# EasyEDA Pro project 单向户外电源_明月班.epro, schematic Schematic2

## Sheets
1 P1: Board Name: 逆变V2.0; Create Date: 2025-09-20; Page Name: P1; Project Name: 单向户外电源; Schematic Name: Schematic2; Update Date: 2025-11-14; Company: 嘉立创EDA; Page Size: A4; Version: V1.0
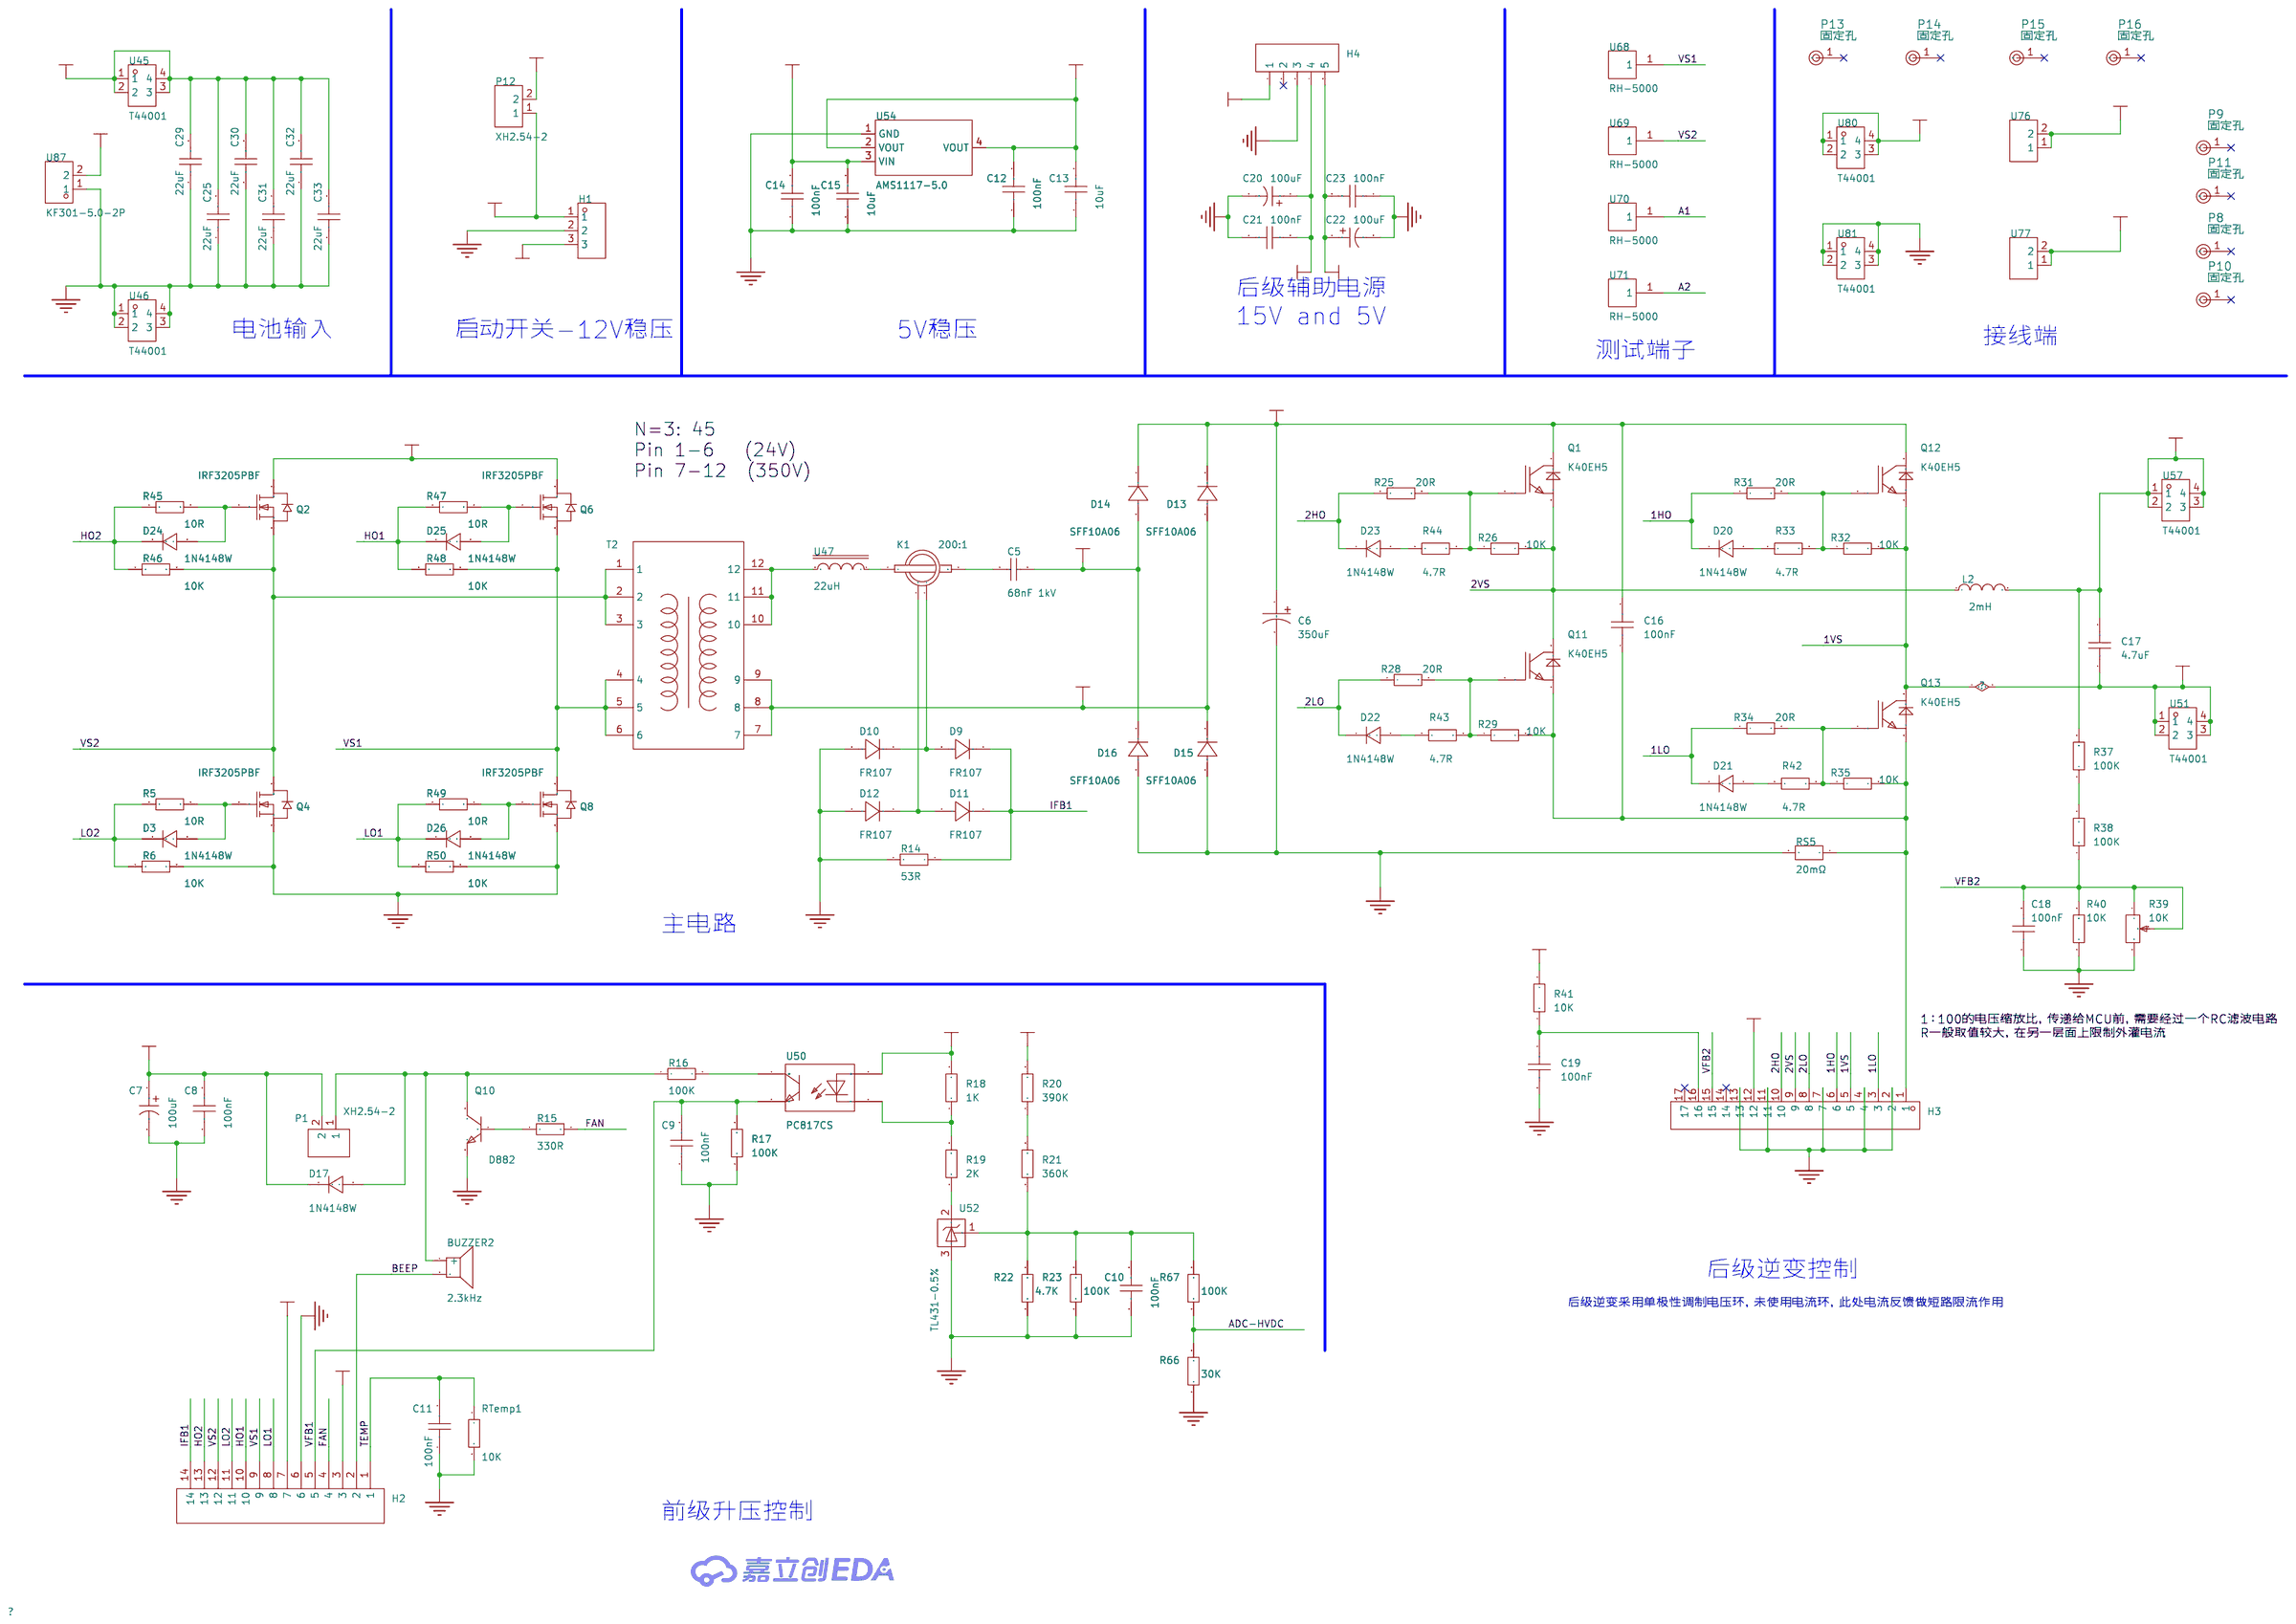
[diagram p6: P1]
2 P2: Create Date: 2025-11-04; Page Name: P2
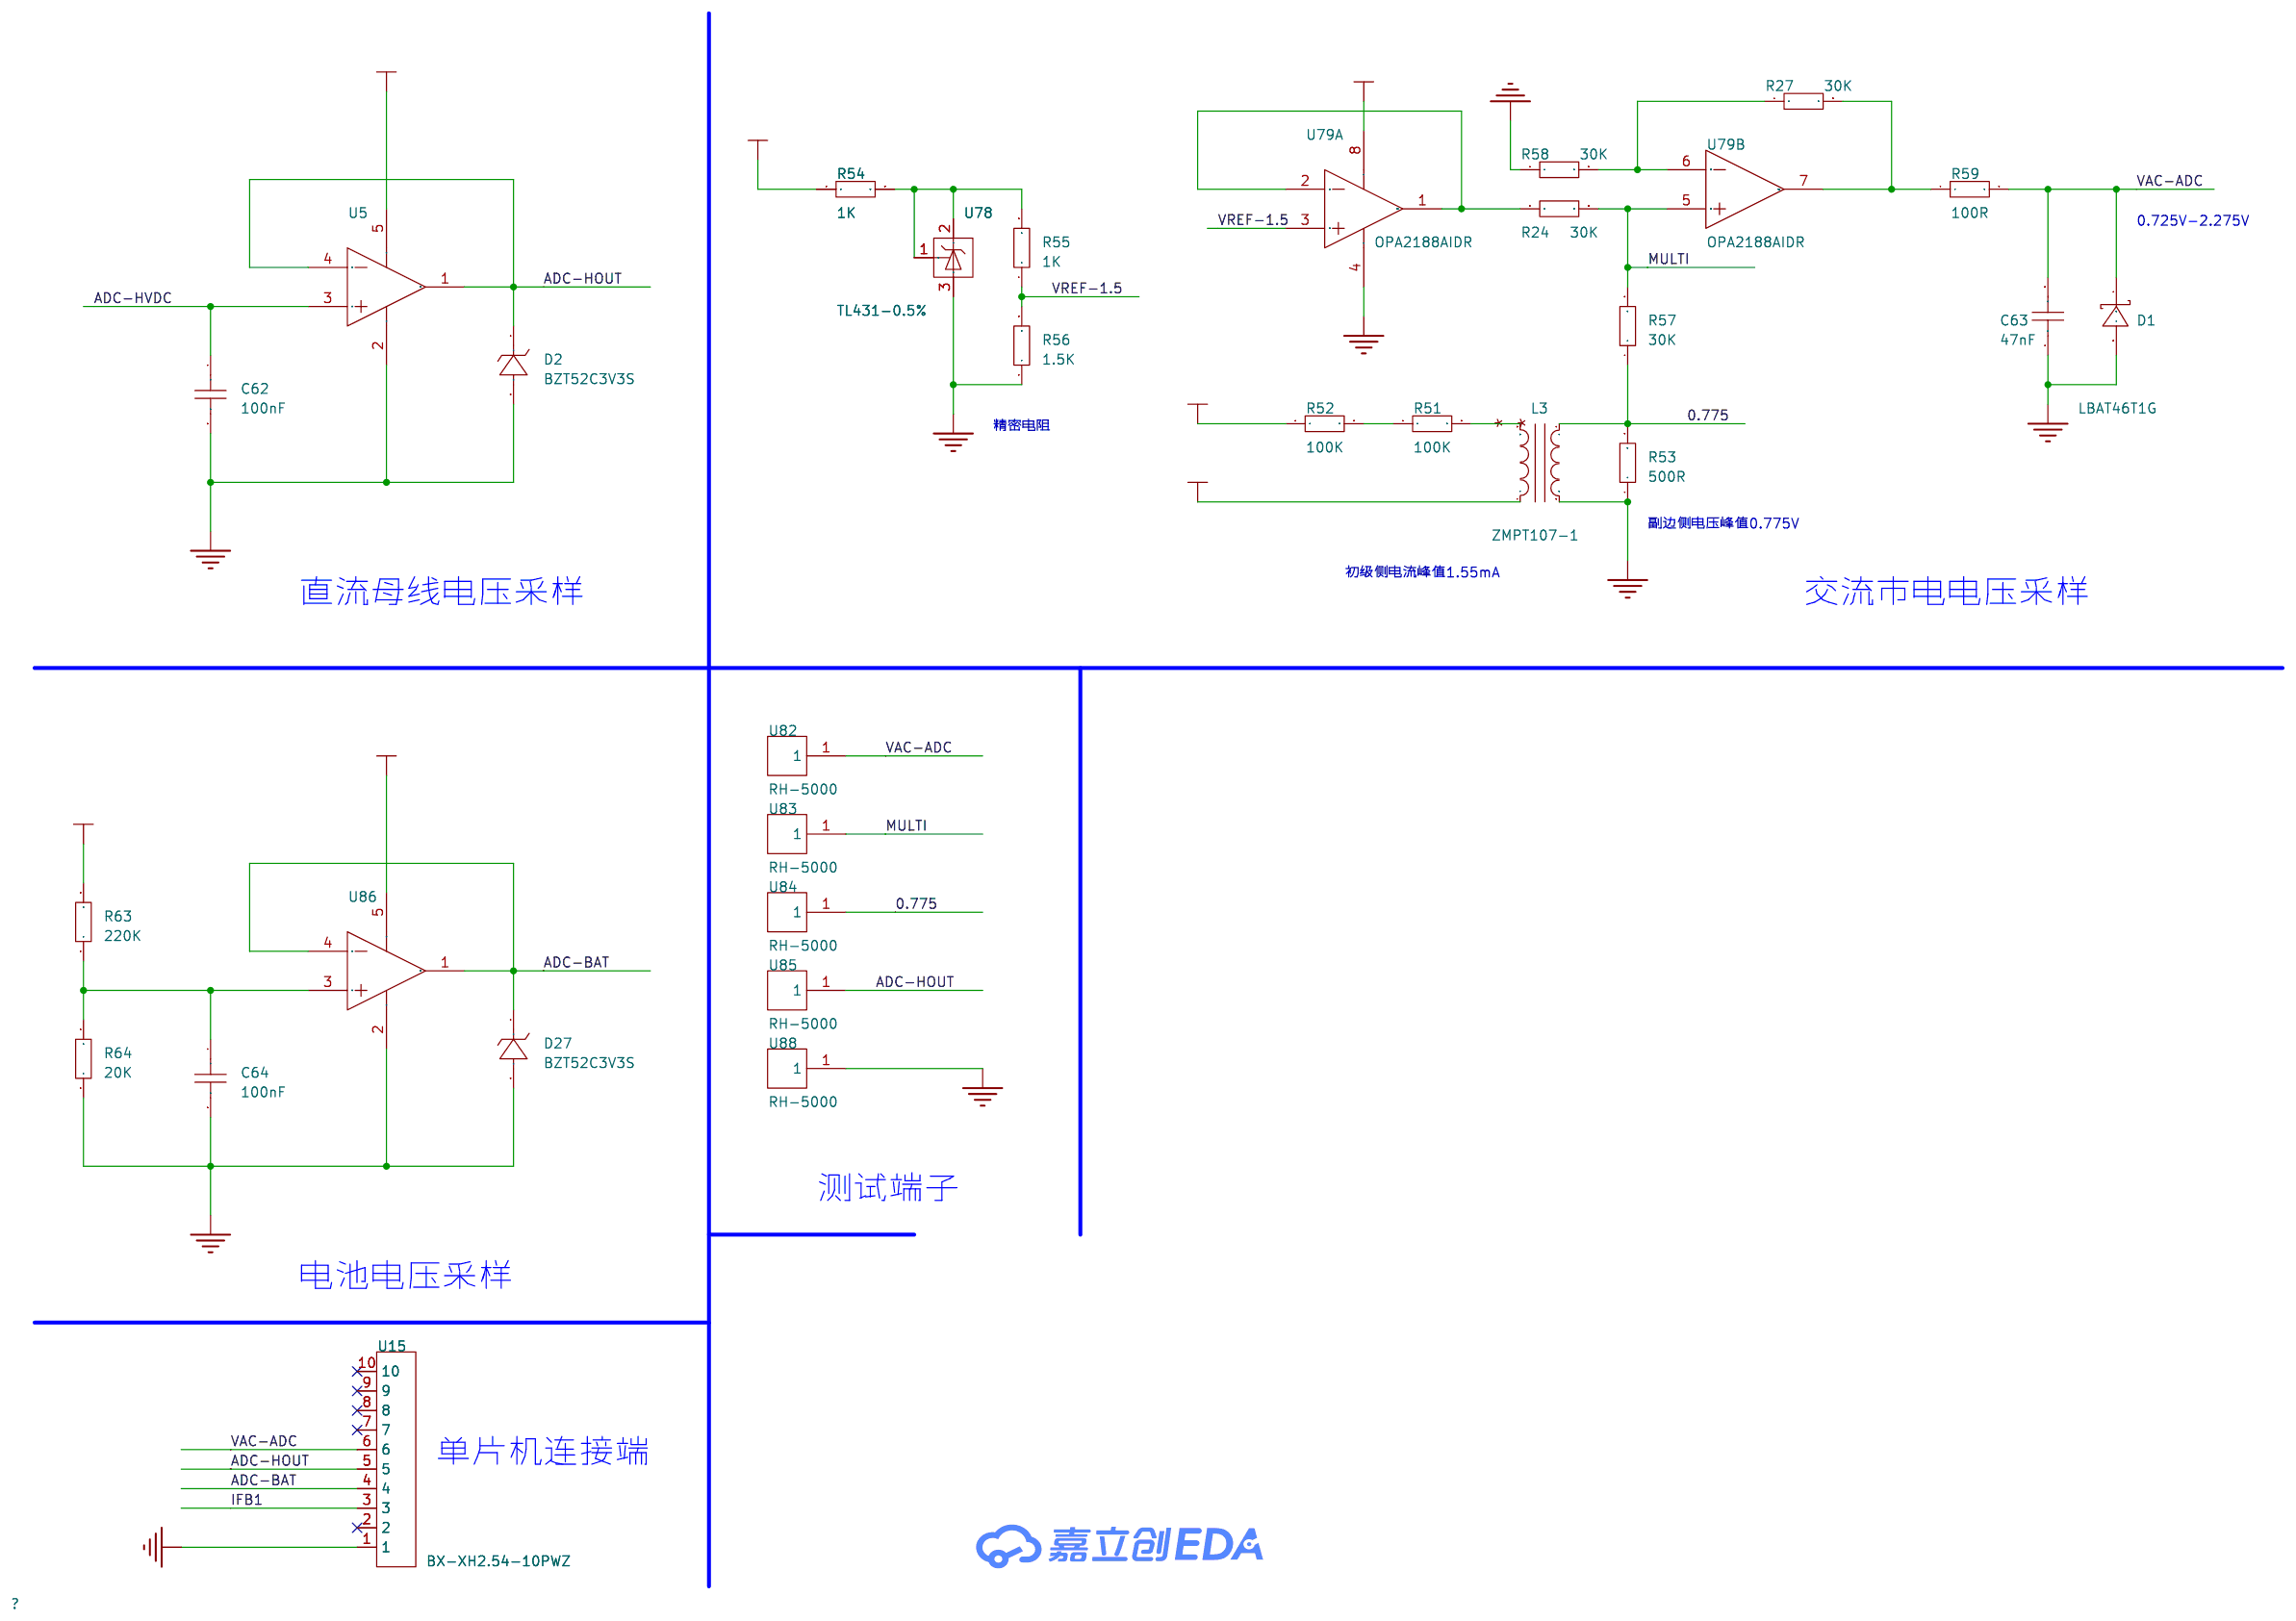
[diagram p7: P2]

## Parts
sheet P1
BUZZER2  2.3kHz  [BUZ-TH_BD12.0-P7.60-D0.6-FD]
C5  68nF 1kV  [CAP-TH_L17.0-W12.0-P15.00-D0.8]
C6  350uF  [CAP-TH_BD25.0-P10.00-D2.3-FD]
C7  100uF  [CAP-TH_BD5.0-P2.00-D0.5-FD-1]
C8  100nF  [C0805]
C9  100nF  [C0805]
C10  100nF  [C0805]
C11  100nF  [C0805]
C12  100nF  [C0805]
C13  10uF  [C0805]
C14  100nF  [C0805]
C15  10uF  [C0805]
C16  100nF  [CAP-TH_L11.5-W5.5-P10.00-D0.6]
C17  4.7uF  [CAP-TH_L28.5-W15.5-P26.0-D0.8]
C18  100nF  [C0805]
C19  100nF  [C0805]
C20  100uF  [CAP-TH_BD5.0-P2.00-D0.5-FD-1]
C21  100nF  [C0805]
C22  100uF  [CAP-TH_BD5.0-P2.00-D0.5-FD-1]
C23  100nF  [C0805]
C25  22uF  [C0805]
C29  22uF  [C0805]
C30  22uF  [C0805]
C31  22uF  [C0805]
C32  22uF  [C0805]
C33  22uF  [C0805]
D3  1N4148W  [SOD-123F_L2.7-W1.6-LS3.8-RD]
D9  FR107  [SMA_L4.2-W2.7-LS5.3-RD]
D10  FR107  [SMA_L4.2-W2.7-LS5.3-RD]
D11  FR107  [SMA_L4.2-W2.7-LS5.3-RD]
D12  FR107  [SMA_L4.2-W2.7-LS5.3-RD]
D13  SFF10A06  [ITO-220AC_L10.2-W4.5-P5.10]
D14  SFF10A06  [ITO-220AC_L10.2-W4.5-P5.10]
D15  SFF10A06  [ITO-220AC_L10.2-W4.5-P5.10]
D16  SFF10A06  [ITO-220AC_L10.2-W4.5-P5.10]
D17  1N4148W  [SOD-123F_L2.7-W1.6-LS3.8-RD]
D20  1N4148W  [SOD-123F_L2.7-W1.6-LS3.8-RD]
D21  1N4148W  [SOD-123F_L2.7-W1.6-LS3.8-RD]
D22  1N4148W  [SOD-123F_L2.7-W1.6-LS3.8-RD]
D23  1N4148W  [SOD-123F_L2.7-W1.6-LS3.8-RD]
D24  1N4148W  [SOD-123F_L2.7-W1.6-LS3.8-RD]
D25  1N4148W  [SOD-123F_L2.7-W1.6-LS3.8-RD]
D26  1N4148W  [SOD-123F_L2.7-W1.6-LS3.8-RD]
H1  -  [HDR-TH_3P-P2.54-V-F]
H2  -  [HDR-TH_14P-P2.54-V-F-1]
H3  -  [HDR-TH_17P-P2.54-V-F]
H4  -  [EG1185辅助电源]
K1  200:1  [FILTER-TH_4P-L12.0-W12.0_FC-CT9825-200T-40A]
L2  2mH  [2mH-D=36,插件脚距16]
P1  XH2.54-2  [CONN-TH_XH2.54-2P]
P8  固定孔  [固定孔]
P9  固定孔  [固定孔]
P10  固定孔  [固定孔]
P11  固定孔  [固定孔]
P12  XH2.54-2  [CONN-TH_XH2.54-2P]
P13  固定孔  [固定孔]
P14  固定孔  [固定孔]
P15  固定孔  [固定孔]
P16  固定孔  [固定孔]
Q1  K40EH5  [TO-247AC-3_L15.8-W5.0-P5.46-L]
Q2  IRF3205PBF  [T0-220]
Q4  IRF3205PBF  [T0-220]
Q6  IRF3205PBF  [T0-220]
Q8  IRF3205PBF  [T0-220]
Q10  D882  [SOT-89-3_L4.5-W2.5-P1.50-LS4.2-BR]
Q11  K40EH5  [TO-247AC-3_L15.8-W5.0-P5.46-L]
Q12  K40EH5  [TO-247AC-3_L15.8-W5.0-P5.46-L]
Q13  K40EH5  [TO-247AC-3_L15.8-W5.0-P5.46-L]
R5  10R  [R0805]
R6  10K  [R0805]
R14  53R  [R0805]
R15  330R  [R0805]
R16  100K  [R0805]
R17  100K  [R0805]
R18  1K  [R0805]
R19  2K  [R0805]
R20  390K  [R0805]
R21  360K  [R0805]
R22  4.7K  [R0805]
R23  100K  [R0805]
R25  20R  [R0805]
R26  10K  [R0805]
R28  20R  [R0805]
R29  10K  [R0805]
R31  20R  [R0805]
R32  10K  [R0805]
R33  4.7R  [R0805]
R34  20R  [R0805]
R35  10K  [R0805]
R37  100K  [R0805]
R38  100K  [R0805]
R39  10K  [RES-ADJ-TH_3362P]
R40  10K  [R0805]
R41  10K  [R0805]
R42  4.7R  [R0805]
R43  4.7R  [R0805]
R44  4.7R  [R0805]
R45  10R  [R0805]
R46  10K  [R0805]
R47  10R  [R0805]
R48  10K  [R0805]
R49  10R  [R0805]
R50  10K  [R0805]
R66  30K  [R0805]
R67  100K  [R0805]
RS5  20mΩ  [R2512]
RTemp1  10K  [R0805]
T2  -  [PQ3535_6+6]
U45  T44001  [CONN-TH_T44001]
U46  T44001  [CONN-TH_T44001]
U47  22uH  [IND-TH_L20.0-W9.0-P8.00-D1.0]
U50  PC817CS  [SOP-4_L6.5-W4.6-P2.54-LS10.2-BL]
U51  T44001  [CONN-TH_T44001]
U52  TL431-0.5%  [SOT-23-3_L2.9-W1.6-P1.90-LS2.8-BR]
U54  AMS1117-5.0  [SOT-223_L6.5-W3.5-P2.30-LS7.0-BR]
U57  T44001  [CONN-TH_T44001]
U68  RH-5000  [TEST-TH_BD2.54-P1.4_RED]
U69  RH-5000  [TEST-TH_BD2.54-P1.4_RED]
U70  RH-5000  [TEST-TH_BD2.54-P1.4_RED]
U71  RH-5000  [TEST-TH_BD2.54-P1.4_RED]
U76  BTC-3-PCB484608T  [TH-2_L8.0-W0.8_C9900056570]
U77  BTC-3-PCB484608T  [TH-2_L8.0-W0.8_C9900056570]
U80  T44001  [CONN-TH_T44001]
U81  T44001  [CONN-TH_T44001]
U87  KF301-5.0-2P  [CONN-TH_P5.00_KF301-5.0-2P]
sheet P2
C62  100nF  [C0805]
C63  47nF  [C0805]
C64  100nF  [C0805]
D1  LBAT46T1G  [SOD-123_L2.7-W1.6-LS3.7-RD-4]
D2  BZT52C3V3S  [SOD-323_L1.7-W1.3-LS2.6-RD]
D27  BZT52C3V3S  [SOD-323_L1.7-W1.3-LS2.6-RD]
L3  ZMPT107-1  [XFMR-TH_ZMPT107-1]
R24  30K  [R0805]
R27  30K  [R0805]
R51  100K  [R0805]
R52  100K  [R0805]
R53  500R  [R0805]
R54  1K  [R0805]
R55  1K  [R0805]
R56  1.5K  [R0805]
R57  30K  [R0805]
R58  30K  [R0805]
R59  100R  [R0805]
R63  220K  [R0805]
R64  20K  [R0805]
U5  TLV333IDBVR  [SOT-23-5_L2.9-W1.6-P0.95-LS2.8-BL]
U15  BX-XH2.54-10PWZ  [CONN-TH_10P-P2.50_BX-XH2.54-10PWZ]
U78  TL431-0.5%  [SOT-23-3_L2.9-W1.6-P1.90-LS2.8-BR]
U79  OPA2188AIDR  [SOIC-8_L4.9-W3.9-P1.27-LS6.0-BL]  (sections 1,2)
U82  RH-5000  [TEST-TH_BD2.54-P1.4_RED]
U83  RH-5000  [TEST-TH_BD2.54-P1.4_RED]
U84  RH-5000  [TEST-TH_BD2.54-P1.4_RED]
U85  RH-5000  [TEST-TH_BD2.54-P1.4_RED]
U86  TLV333IDBVR  [SOT-23-5_L2.9-W1.6-P0.95-LS2.8-BL]
U88  RH-5000  [TEST-TH_BD2.54-P1.4_RED]

## Library data of the parts
BUZZER2 = TMB12A12_C96079: 驱动方式:有源(内含驱动线路);构造类型:电磁式;频率:2.3kHz;声压(SPL):85dB;; LCSC Part Name: TMB12A12; Supplier Part: C96079; Manufacturer: 华能; Manufacturer Part: TMB12A12; Supplier Footprint: 插件,D=12mm; JLCPCB Part Class: 扩展库; Datasheet: https://atta.szlcsc.com/upload/public/pdf/source/20170522/1495448324467.pdf; Supplier: LCSC; Oscillator Circuit: 有源(内含驱动线路); Technology Type: 电磁式; Operating Voltage: 8V~16V; Sound Pressure Level (SPL): 85dB; Diameter (φD): 12mm; Height: 9.8mm
C5 = PS683J3A1502: 容值:68nF;精度:±5%;额定电压:1kV;工作温度:-40℃~+100℃;; LCSC Part Name: 68nF ±5% 1kV; Supplier Part: C478444; Manufacturer: KYET(科雅); Supplier Footprint: 插件,P=15mm; JLCPCB Part Class: 扩展库; Datasheet: https://atta.szlcsc.com/upload/public/pdf/source/20200102/C478444_4F70048084F20B040C2A21F2E8B9CC60.pdf; Supplier: LCSC; Tolerance: ±5%; Voltage Rated: 1kV; Operating Temperature: -40℃~+100℃
C6 = TLA450V220UF25.4*40: 容值:220uF;精度:±20%;额定电压:450V;脚间距:10mm;等效串联电阻(ESR):-;纹波电流:1A@120Hz;; LCSC Part Name: 220uF ±20% 450V; Supplier Part: C150385; Manufacturer: SAMYOUNG(韩国三莹); Supplier Footprint: 插件,D25.4xL40mm; JLCPCB Part Class: 扩展库; Datasheet: https://atta.szlcsc.com/upload/public/pdf/source/20171221/C150385_15138312224721195452.pdf; Supplier: LCSC; Tolerance: ±20%; Voltage Rating: 450V; Pin Spacing: 10mm; Ripple Current: 1A@120Hz; Diameter: 25.4mm; Height - Seated (Max): 40mm; Lifetime: 3000hrs@105℃; Operating Temperature: -25℃~+105℃
C7 C20 C22 = JBLE2101M025A080RLM 100UF 25V: 容值:100uF;精度:±20%;额定电压:25V;纹波电流:1.1A@100kHz;等效串联电阻(ESR):40mΩ@100kHz;; LCSC Part Name: 100uF ±20% 25V; Supplier Part: C19270657; Manufacturer: DMBJ(振宝佳); Supplier Footprint: 插件,D5xL8mm; JLCPCB Part Class: 扩展库; Datasheet: https://atta.szlcsc.com/upload/public/pdf/source/20240115/41B2053578AA7A05F5193847DE8DA961.pdf; Supplier: LCSC; Tolerance: ±20%; Voltage Rating: 25V; Ripple Current: 1.1A@100kHz; Equivalent Series Resistance(ESR): 40mΩ@100kHz; Lifetime: 2000hrs@105℃
C8-C15 C18 C19 C21 C23 C62-C64 = CAP_0805: Supplier Footprint: 0805
C16 = CBB21-630V104JP10: 容值:100nF;精度:±5%;额定电压:630V;工作温度:-40℃~+105℃;; LCSC Part Name: 100nF ±5% 630V; Supplier Part: C2888191; Manufacturer: 东通电子; Supplier Footprint: 插件,P=10mm; JLCPCB Part Class: 扩展库; Datasheet: https://atta.szlcsc.com/upload/public/pdf/source/20210928/C2888191_1A852CE2E5E8A960951618999EAEF1BB.pdf; Supplier: LCSC; Tolerance: ±5%; Voltage Rated: 630V; Operating Temperature: -40℃~+105℃
C17 = KP475J2J2603: 容值:4.7uF;精度:±5%;额定电压:630V;工作温度:-40℃~+100℃;; LCSC Part Name: 4.7uF ±5% 630V; Supplier Part: C3019080; Manufacturer: KYET(科雅); Supplier Footprint: 插件,P=26mm; JLCPCB Part Class: 扩展库; Datasheet: https://atta.szlcsc.com/upload/public/pdf/source/20220523/12B2B36D66F3FE6DA8C3B05150F96247.pdf; Supplier: LCSC; Tolerance: ±5%; Voltage Rated: 630V; Operating Temperature: -40℃~+100℃
C25 C29-C33 = CL21A226MAQNNNE: 容值:22uF;精度:±20%;额定电压:25V;温度系数:X5R;; LCSC Part Name: 22uF ±20% 25V; Supplier Part: C45783; Manufacturer: SAMSUNG(三星); Supplier Footprint: 0805; JLCPCB Part Class: 基础库; Datasheet: https://item.szlcsc.com/datasheet/CL21A226MAQNNNE/46786.html; Supplier: LCSC; Tolerance: ±20%; Voltage Rating: 25V; Temperature Coefficient: X5R
D3 D17 D20-D26 = 1N4148W_C81598: 二极管配置:独立式;正向压降(Vf):1V@50mA;直流反向耐压(Vr):75V;整流电流:150mA;反向恢复时间(Trr):4ns;; Supplier Part: C81598; Manufacturer: ST(先科); Supplier Footprint: SOD-123; JLCPCB Part Class: 基础库; Datasheet: https://item.szlcsc.com/datasheet/1N4148W/82750.html; Supplier: LCSC; Diode Configuration: 独立式; Voltage - Forward(Vf@If): 1V@50mA; Voltage - DC Reverse(Vr): 75V; Current - Rectified: 150mA; Pd - Power Dissipation: 400mW; Reverse Leakage Current (Ir): 1uA@75V; Reverse Recovery Time (trr): 4ns; Non-Repetitive Peak Forward Surge Current: 1A
D9-D12 = FR107_C2892324: 二极管配置:1个独立式;正向压降(Vf):1.3V@1A;直流反向耐压(Vr):1kV;整流电流:1A;反向恢复时间(Trr):500ns;; Supplier Part: C2892324; Manufacturer: YONGYUTAI(永裕泰); Supplier Footprint: SMA; JLCPCB Part Class: 扩展库; Datasheet: https://item.szlcsc.com/datasheet/FR107/3124344.html; Supplier: LCSC; Diode Configuration: 1个独立式; Voltage - Forward(Vf@If): 1.3V@1A; Voltage - DC Reverse(Vr): 1kV; Current - Rectified: 1A; Reverse Leakage Current (Ir): 5uA@1kV; Reverse Recovery Time (trr): 500ns; Operating Junction Temperature Range: -55℃~+150℃; Non-Repetitive Peak Forward Surge Current: 30A
D13-D16 = SFF1006UF: 二极管配置:1个独立式;正向压降(Vf):1.7V@10A;直流反向耐压(Vr):600V;整流电流:10A;反向恢复时间(Trr):35ns;; Supplier Part: C7427747; Manufacturer: NH(纽航); Supplier Footprint: ITO-220AC; JLCPCB Part Class: Extended Part; Datasheet: https://item.szlcsc.com/datasheet/SFF1006UF/8422096.html; Supplier: LCSC; Diode Configuration: 1个独立式; Voltage - Forward(Vf@If): 1.7V@10A; Voltage - DC Reverse(Vr): 600V; Current - Rectified: 10A; Reverse Leakage Current (Ir): 5uA; Reverse Recovery Time (trr): 35ns; Non-Repetitive Peak Forward Surge Current: 100A
H1 = HDR-F_2.54_1x3P: Supplier Part: C541850; Supplier Footprint: 插件
H2 = HDR-F-2.54_1x14P: Supplier Part: C52711; Supplier Footprint: 插件
H3 = HDR-F_2.54_1x17P: Supplier Part: C2897380; Supplier Footprint: 插件
H4 = HDR-F_2.54_1x5P: Supplier Part: C50950; Supplier Footprint: 插件
K1 = 200:1: Published: 24-Mar-1999; LatestRevisionDate: 17-Jul-2002; LatestRevisionNote: Re-released for DXP Platform.; PackageReference: MODULE5B; Publisher: Altium Limited
L2 = XR050125T101MVL7: 电感值:100uH;精度:±10%;额定电流:3.8A;类型:磁环电感;; LCSC Part Name: 100uH ±10% 磁环电感; Supplier Part: C18213920; Manufacturer: XR(祥如); Supplier Footprint: 插件,D=15.8mm; JLCPCB Part Class: 扩展库; Datasheet: https://atta.szlcsc.com/upload/public/pdf/source/20231010/3953EFE02023CF281EBE5E0AF59C2C67.pdf; Supplier: LCSC; Tolerance: ±10%; Rated Current: 3.8A; Type: 磁环电感; Wire Diameter: 0.7mm
P1 P12 = XH2.54直插座-2P: Supplier Part: C9900016957; JLCPCB Part Class: 扩展库; Supplier: LCSC
P8-P11 P13-P16 = 固定孔
Q1 Q11-Q13 = IKW20N60T: Vce=600V，Ic=20A，Vce(sat)=1.5V; Supplier Part: C10456; Manufacturer: Infineon(英飞凌); Supplier Footprint: TO-247AC-3; JLCPCB Part Class: 扩展库; Datasheet: https://atta.szlcsc.com/upload/public/pdf/source/20121215/1457706569365.pdf; Supplier: LCSC
Q2 Q4 Q6 Q8 = IRF3205PBF: Supplier: LCSC; Manufacturer: Infineon(英飞凌); Supplier Part: C2561; JLCPCB Part Class: Extended Part
Q10 = D882(RANGE:160-320)_C9634: 晶体管类型:NPN;集电极电流(Ic):3A;集射极击穿电压(Vceo):30V;耗散功率(Pd):500mW;直流电流增益(hFE):160@1A,2V;; LCSC Part Name: Y档 160~320; Supplier Part: C9634; Manufacturer: CJ(江苏长电/长晶); Supplier Footprint: SOT-89-3; JLCPCB Part Class: 基础库; Datasheet: https://atta.szlcsc.com/upload/public/pdf/source/20121027/1457706543612.pdf; Supplier: LCSC; type: NPN; Current - Collector(Ic): 3A; Collector - Emitter Voltage VCEO: 30V; Pd - Power Dissipation: 500mW; DC Current Gain: 160@1A,2V; Transition frequency(fT): 50MHz; Current - Collector Cutoff: 1uA; Vce Saturation(VCE(sat)): 500mV; Operating Temperature: -55℃~+150℃
R5 R6 R14-R29 R31-R35 R37 R38 R40-R59 R63 R64 R66 R67 RTemp1 = Res_0805: Supplier Footprint: 0805
R39 = 3362P-1-104_C5048: 阻值:-;功率:-;; LCSC Part Name: 100KΩ ±10% ±250ppm/℃; Supplier Part: C5048; Manufacturer Part: 3362P-1-104; Supplier Footprint: 3362P; JLCPCB Part Class: 扩展库; Supplier: LCSC
RS5 = RLP25FEGR010: 阻值:10mΩ;精度:±1%;功率:3W;温度系数:±50ppm/℃;; LCSC Part Name: 10mΩ ±1% 3W; Supplier Part: C393070; Manufacturer: 大毅科技; Supplier Footprint: 2512; JLCPCB Part Class: 扩展库; Datasheet: https://atta.szlcsc.com/upload/public/pdf/source/20191209/C467441_D59F70B0A5C6980F35DB1CB3CCA97CC4.pdf; Supplier: LCSC; Tolerance: ±1%; Power(Watts): 3W; Temperature Coefficient: ±50ppm/℃
T2 = PQ3535
U45 U46 U51 U57 U80 U81 = T44001: LCSC Part Name: 四脚 M4 二件套; Supplier Part: C481447; Manufacturer: XFCN(兴飞); Supplier Footprint: 插件; JLCPCB Part Class: 扩展库; Datasheet: https://atta.szlcsc.com/upload/public/pdf/source/20200107/C481448_4214B4EB74A46B70BD82BA8A456D4EDD.pdf; Supplier: LCSC
U47 = XR065125T680MV1L: 电感值:68uH;精度:±10%;额定电流:7.8A;类型:环形电感;; Supplier Part: C18213932; Manufacturer: XR(祥如); Supplier Footprint: 插件,D=20mm; JLCPCB Part Class: 扩展库; Datasheet: https://atta.szlcsc.com/upload/public/pdf/source/20231010/22999CD70C41D42FB8CE3B16DBFB61FA.pdf; Supplier: LCSC; Tolerance: ±10%; Current Rating: 7.8A; Type: 环形电感; Wire Diameter: 1mm
U50 = PC817CS_C48642466: 输入类型:DC;正向压降(Vf):1.2V;输出电流:50mA;隔离电压(Vrms):5kV;直流反向耐压(Vr):6V;负载电压:80V;输出通道数:1;集射极饱和电压(VCE(sat)):100mV@20mA,1mA;; Supplier Part: C48642466; Manufacturer: QNHCHIP(乾能惠); Supplier Footprint: SOP-4; JLCPCB Part Class: 扩展库; Datasheet: https://item.szlcsc.com/datasheet/PC817CS/50921808.html; Supplier: LCSC; Input type: DC; Output Type: 光电三极管; Voltage - Forward(Vf): 1.2V; Output Current: 50mA; Isolation Voltage(Vrms): 5kV; Reverse Voltage: 6V; Load Voltage: 80V; Number of Outputs: 1; Vce Saturation(VCE(sat)): 100mV@20mA,1mA; Rise time: 4us; Fall time: 3us; Operating Temperature: 55℃~+110℃; Current Transfer Ratio (CTR) Minimum: 50%; Current Transfer Ratio (CTR) Maximum/Saturation Value: 600%; Total Power Dissipation(Pd): 200mW; Forward Current(If): 50mA
U52 U78 = TL431-0.5%_C2874163: LCSC Part Name: TL431-0.5% 停产; Supplier Part: C2874163; Manufacturer: GOFORD(谷峰); Supplier Footprint: SOT-23; JLCPCB Part Class: 扩展库; Datasheet: https://atta.szlcsc.com/upload/public/pdf/source/20210810/02A0BB82282FBCACF58140E8DCCF3C6A.pdf; Supplier: LCSC
U54 = AMS1117-5.0_C6187: 输出类型:固定;工作电压:12V;输出电压:5V;输出电流:1A;电源纹波抑制比(PSRR):-;输出极性:正极;; LCSC Part Name: 输入12V 输出5V 1A; Supplier Part: C6187; Manufacturer: AMS; Supplier Footprint: SOT-223; JLCPCB Part Class: 基础库; Datasheet: https://atta.szlcsc.com/upload/public/pdf/source/20230918/E4B716057EE82179D88E8A0894830D59.pdf; Supplier: LCSC; Output Type: 固定; Voltage - Supply: 12V; Output Voltage: 5V; Output Current: 1A; Voltage Dropout: 1.3V@(1A); Features: 过流保护(OCP); Output Configuration: 正极; Number of Outputs: 1
U68-U71 U82-U85 U88 = RH-5000: LCSC Part Name: PCB电路板测试点/测试针; Supplier Part: C5277086; Manufacturer: 荣和; JLCPCB Part Class: 扩展库; Datasheet: https://atta.szlcsc.com/upload/public/pdf/source/20230704/1671C2774A3D6CEDC1FD6AAF48538C87.pdf; Supplier: LCSC
U76 U77 = BTC-3-PCB484608T: LCSC Part Name: PCB防倒插端子、接线端子4.8*0.8 焊插片 冷压端4.8mm线路板插片公插; Supplier Part: C20626099; Manufacturer: BZXC(博众新材); Supplier Footprint: 插件; JLCPCB Part Class: 扩展库; Datasheet: https://item.szlcsc.com/datasheet/BTC-3-PCB484608T/22034729.html; Supplier: LCSC
U87 = KF301-5.0-2P: 结构:1x2P;间距:5mm;颜色:蓝色;安装方式:直插;额定电流:17A;额定电压:250V;排数:1;线规 - AWG:14~22;线规 - 平方毫米:1.5;每排PIN数:2;工作温度范围:-30℃~+120℃;; LCSC Part Name: 5mm 1x2P 排数:1 每排P数:2 直插; Supplier Part: C474881; Manufacturer: KEFA(科发); Supplier Footprint: 插件,P=5mm; JLCPCB Part Class: 扩展库; Datasheet: https://atta.szlcsc.com/upload/public/pdf/source/20230317/03A5B5FC229D6F9225E8F51DA1A4E80A.pdf; Supplier: LCSC; Structure: 1x2P; Pitch: 5mm; Color: 蓝色; Mounting Style: 直插; Current Rating (Max): 17A; Voltage Rating (Max): 250V; Number of Pins: 2P; Number of Rows: 1; Wire Gauge - AWG: 14~22; Wire Gauge - mm2: 1.5; Number of PINs Per Row: 2; Operating Temperature Range: -30℃~+120℃
D1 = LBAT46T1G: 正向压降(Vf):250mV;直流反向耐压(Vr):100V;整流电流:150mA;; LCSC Part Name: 电压:100V 电流:150mA; Supplier Part: C383177; Manufacturer: LRC(乐山无线电); Supplier Footprint: SOD-123; JLCPCB Part Class: 扩展库; Datasheet: https://atta.szlcsc.com/upload/public/pdf/source/20190402/C383177_91B671A097C80DD68CF84040E8658840.pdf; Supplier: LCSC; Forward Voltage (Vf@If): 250mV; Reverse Voltage (Vr): 100V; Rectified Current: 150mA; Reverse Leakage Current (Ir): 500nA
D2 D27 = BZT52C3V3S_C19077437: 二极管配置:独立式;稳压值(标称值):3.3V;稳压值(范围):3.1V~3.5V;功率(Pd):200mW;; Supplier Part: C19077437; Manufacturer: 宏迦橙; Supplier Footprint: SOD-323; JLCPCB Part Class: 扩展库; Datasheet: https://atta.szlcsc.com/upload/public/pdf/source/20231117/06CD1C2A69B3FFC97FEAE4263E1B2FE9.pdf; Supplier: LCSC; Diode Configuration: 独立式; Zener Voltage (Nom): 3.3V; Reverse Leakage Current (Ir): 5uA@1V; Zener Voltage (Range): 3.1V~3.5V; Power Dissipation: 200mW; Zener Impedance (Zzt): 95Ω
L3 = ZMPT107-1_C125191: 类型:电压互感器;匝数比:1:1;额定输入电流:2mA;额定输出电流:2mA;频率:-;次级侧电感值:-;; Supplier Part: C125191; Manufacturer: 择明朗熙; Supplier Footprint: 插件; JLCPCB Part Class: 扩展库; Datasheet: https://item.szlcsc.com/datasheet/ZMPT107-1/136467.html; Supplier: LCSC; Type: 电压互感器; Turns Ratio: 1:1; Rated input Current: 2mA; Rated Output Current: 2mA; Linearity: 0.2%
U5 U86 = TLV333IDBVR: 放大器数:单路;增益带宽积(GBP):350kHz;输入偏置电流(Ib):70pA;输入失调电压(Vos):2uV;压摆率(SR):0.16V/us;轨到轨:-;; Supplier Part: C473369; Manufacturer: TI(德州仪器); Supplier Footprint: SOT-23-5; JLCPCB Part Class: 扩展库; Datasheet: https://www.ti.com/cn/lit/gpn/tlv333; Supplier: LCSC; Number of Circuits: 单路; Gain Bandwidth Product(GBP): 350kHz; Current - Input Bias(Ib): 70pA; Voltage - Input Offset(Vos): 2uV; Slew Rate(SR): 0.16V/us; Operating Temperature: -40℃~+125℃
U15 = BX-XH2.54-10PWZ: 插针结构:1x10P;间距:2.5mm;安装方式:弯插;参考系列:XH;总PIN数:10P;排数:1;每排PIN数:10;行距:-;额定电流:3A;触头材质:黄铜;触头镀层:锡;工作温度:-25℃~+85℃;; LCSC Part Name: 1x10P 间距:2.5mm 弯插 系列:XH; Supplier Part: C18077850; Manufacturer: Bossie(博锡); Supplier Footprint: 弯插,P=2.54mm; JLCPCB Part Class: 扩展库; Datasheet: https://item.szlcsc.com/datasheet/BX-XH2.54-10PWZ/19218251.html; Supplier: LCSC; Pins Structure: 1x10P; Pitch: 2.5mm; Mounting Type: 弯插; Reference Series: XH; Number of Pins: 10P; Number of Rows: 1; Number of PINs Per Row: 10; Current Rating: 3A; Contact Material: 黄铜; Contact Plating: 锡; Operating Temperature: -25℃~+85℃; Voltage Rating: 250V; Plastic Material: PA66; Flame Retardant Rating: UL94V-0; Color: 白色; Z-Height of the Board: 5.9mm; X-Length of Bottom Edge on Board (Spacing Line): 27.5mm; Y-Width of Bottom Edge on Board: 7.32mm
U79 = OPA2188AIDR: 放大器数:双路;增益带宽积(GBP):2MHz;输入偏置电流(Ib):160pA;输入失调电压(Vos):6uV;压摆率(SR):0.8V/us;轨到轨:轨到轨输出;; LCSC Part Name: OPA2188AIDR  零漂移; Supplier Part: C17271; Manufacturer: TI(德州仪器); Supplier Footprint: SOIC-8; JLCPCB Part Class: 扩展库; Datasheet: https://www.ti.com/cn/lit/gpn/opa2188; Supplier: LCSC; Number of Channels: 双路; Gain Bandwidth Product: 2MHz; Ib - Input Bias Current: 160pA; Vos - Input Offset Voltage: 6uV; Common Mode Rejection Ratio(CMRR): 146dB; Slew Rate: 0.8V/us; Output Current: 18mA; Rail to Rail: 轨到轨输出; Quiescent Current(Iq): 475uA; Operating Temperature: -40℃~+105℃; Single Supply: 4V~36V; Dual Supply: -18V~-2V；2V~18V; Maximum Power Supply Range (Vdd-Vss): 36V; Noise density(eN): 8.8nV/√Hz@1kHz; Input Offset Current(Ios): 320pA

## Nets
2VS: H3.9 L2.1 Q1.3(E) Q11.2(C) R26.2
5V-1: C12.2 C13.2 R18.2 R54.1 U5.5(V+) U50.1(Anode) U54.2(VOUT) U54.4(VOUT) U79.8(V+) U86.5(V+)
5V-2: C22.1 C23.2 H4.5 R41.2
12V: C7.1 C8.2 C14.2 C15.2 D17.1(K) H1.3 H2.7 P1.2 U54.3(VIN)
15V: C20.1 C21.2 H3.12 H4.4
350V: C6.1 C16.2 D13.1(K) D14.1(K) H4.1 Q1.2(C) Q12.2(C) R20.2 U80.1 U80.2 U80.3 U80.4
GND1: C7.2 C8.1 C9.1 C11.1 C12.1 C13.1 C14.1 C15.1 C25.1 C29.1 C30.1 C31.1 C32.1 C33.1 C62.2 C63.1 C64.2 D1.2(A) D2.2(A) D10.2(A) D12.2(A) D27.2(A) H1.2 H2.6 L3.2 Q4.3(S) Q8.3(S) Q10.3(E) R6.2 R14.2 R17.1 R50.2 R53.1 R56.1 R58.1 R64.1 R66.1 RTemp1.2 U5.2(V-) U15.1 U46.1 U46.2 U46.3 U46.4 U54.1(GND) U78.3(A) U79.4(V-) U86.2(V-) U87.1 U88.1
GND2: C6.2 C10.1 C18.1 C19.2 C20.2 C21.1 C22.2 C23.1 D15.2(A) D16.2(A) H3.2 H3.4 H3.7 H3.11 H3.13 H4.3 R22.1 R23.1 R39.3 R40.1 RS5.2 U52.3(A) U81.1 U81.2 U81.3 U81.4
0.775: L3.1 R53.2 R57.1 U84.1
1HO: D20.1(K) H3.6 R31.1
1LO: D21.1(K) H3.3 R34.1
2HO: D23.1(K) H3.10 R25.1
2LO: D22.1(K) H3.8 R28.1
A1: C5.1 D14.2(A) D16.1(K) U70.1
A2: D13.2(A) D15.1(K) T2.7 T2.8 T2.9 U71.1
ADC-BAT: D27.1(K) U15.4 U86.1(OUT) U86.4(IN-)
ADC-HOUT: D2.1(K) U5.1(OUT) U5.4(IN-) U15.5 U85.1
ADC-HVDC: C62.1 R66.2 R67.1 U5.3(IN+)
BAT: H1.1 H2.3 P12.1 R63.2
BAT+: C25.2 C29.2 C30.2 C31.2 C32.2 C33.2 P12.2 Q2.2(D) Q6.2(D) U45.1 U45.2 U45.3 U45.4 U87.2
BEEP: BUZZER2.2 H2.2
FAN: H2.4 R15.2
HO1: D25.1(K) H2.10 R47.1 R48.1
HO2: D24.1(K) H2.13 R45.1 R46.1
IFB1: D9.1(K) D11.1(K) H2.14 R14.1 U15.3
L: C17.2 L2.2 R37.2 R52.1 U57.1 U57.2 U57.3 U57.4 U76.1 U76.2
LO1: D26.1(K) H2.8 R49.1 R50.1
LO2: D3.1(K) H2.11 R5.1 R6.1
MULTI: R24.2 R57.2 U79.5(IN B+) U83.1
N: C17.1 H3.5 L3.4 Q12.3(E) Q13.2(C) R32.2 U51.1 U51.2 U51.3 U51.4 U77.1 U77.2
TEMP: C11.2 H2.1 RTemp1.1
VAC-ADC: C63.2 D1.1(C) R59.2 U15.6 U82.1
VFB1: C9.2 H2.5 R17.2 U50.3(Emitter)
VFB2: C18.2 H3.15 R38.1 R39.1 R39.2 R40.2
VREF-1.5: R55.1 R56.2 U79.3(IN A+)
VS1: H2.9 Q6.3(S) Q8.2(D) R48.2 T2.4 T2.5 T2.6 U68.1
VS2: H2.12 Q2.3(S) Q4.2(D) R46.2 T2.1 T2.2 T2.3 U69.1
$1N2976: D3.2(A) Q4.1(G) R5.2
$1N3003: K1.4 U47.1
$1N3004: C5.2 K1.3
$1N3005: D9.2(A) D10.1(K) K1.1
$1N3006: D11.2(A) D12.1(K) K1.2
$1N3018: BUZZER2.1(+) D17.2(A) P1.1 Q10.2(C) R16.1
$1N3020: Q10.1(B) R15.1
$1N3027: R19.1 U52.2(K)
$1N3029: R20.1 R21.2
$1N3030: C10.2 R21.1 R22.2 R23.2 R67.2 U52.1(R)
$1N3060: R18.1 R19.2 U50.2(Cathode)
$1N3062: R16.2 U50.4(Collector)
$1N4628: D23.2(A) R44.1
$1N4629: Q1.1(G) R25.2 R26.1 R44.2
$1N4634: D22.2(A) R43.1
$1N4635: Q11.1(G) R28.2 R29.1 R43.2
$1N4638: C16.1 H3.1 Q11.3(E) Q13.3(E) R29.2 R35.2 RS5.1
$1N4639: D20.2(A) R33.1
$1N4640: Q12.1(G) R31.2 R32.1 R33.2
$1N4643: D21.2(A) R42.1
$1N4644: Q13.1(G) R34.2 R35.1 R42.2
$1N4650: R37.1 R38.2
$1N4670: C19.1 H3.16 R41.1
$1N12181: T2.10 T2.11 T2.12 U47.2
$1N13439: D24.2(A) Q2.1(G) R45.2
$1N13533: D25.2(A) Q6.1(G) R47.2
$1N13626: D26.2(A) Q8.1(G) R49.2
$3N1175: L3.3 R51.2
$3N1182: R54.2 R55.2 U78.1(R) U78.2(K)
$3N1188: R24.1 U79.1(OUT A) U79.2(IN A-)
$3N1193: R27.1 R58.2 U79.6(IN B-)
$3N1194: R27.2 R59.1 U79.7(OUT B)
$3N1198: R51.1 R52.2
$3N1910: C64.1 R63.1 R64.2 U86.3(IN+)

Not connected (* = marked no-connect by the designer): H3 14* 17*; H4 2*; P8 1(3mm洞)*; P9 1(3mm洞)*; P10 1(3mm洞)*; P11 1(3mm洞)*; P13 1(3mm洞)*; P14 1(3mm洞)*; P15 1(3mm洞)*; P16 1(3mm洞)*; U15 2* 7* 8* 9* 10*

## Notes on the sheets
sheet 1
- 后级辅助电源
  15V and 5V
- 电池输入
- 启动开关-12V稳压
- 5V稳压
- 接线端
- 测试端子
- N=3: 45
  Pin 1-6   (24V)
  Pin 7-12  (350V)
- 主电路
- 1：100的电压缩放比，传递给MCU前，需要经过一个RC滤波电路
  R一般取值较大，在另一层面上限制外灌电流
- 后级逆变控制
- 后级逆变采用单极性调制电压环，未使用电流环，此处电流反馈做短路限流作用
- 前级升压控制
sheet 2
- 0.725V-2.275V
- 精密电阻
- 副边侧电压峰值0.775V
- 初级侧电流峰值1.55mA
- 直流母线电压采样
- 交流市电电压采样
- 测试端子
- 电池电压采样
- 单片机连接端
